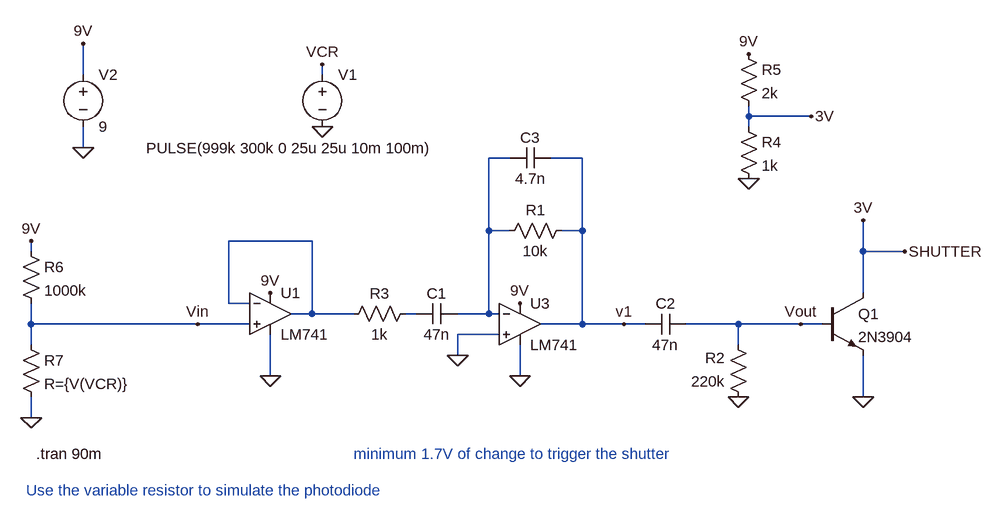
[diagram p0: schematic lightning trigger slow.asc]
lightning trigger slow.asc, the LTspice schematic file:
Version 4
SHEET 1 984 680
WIRE -560 -128 -560 -176
WIRE -192 -128 -192 -144
WIRE 464 -64 464 -80
WIRE 560 -64 464 -64
WIRE 464 -48 464 -64
WIRE -560 -16 -560 -48
WIRE 96 0 64 0
WIRE 208 0 160 0
WIRE 64 112 64 0
WIRE 96 112 64 112
WIRE 208 112 208 0
WIRE 208 112 176 112
WIRE -208 128 -336 128
WIRE -640 144 -640 128
WIRE 640 144 640 96
WIRE 704 144 640 144
WIRE 640 208 640 144
WIRE -336 224 -336 128
WIRE -304 224 -336 224
WIRE -208 240 -208 128
WIRE -208 240 -240 240
WIRE -144 240 -208 240
WIRE -48 240 -64 240
WIRE 64 240 64 112
WIRE 64 240 16 240
WIRE 80 240 64 240
WIRE -640 256 -640 224
WIRE -384 256 -640 256
WIRE -304 256 -384 256
WIRE 208 256 208 112
WIRE 208 256 144 256
WIRE 272 256 208 256
WIRE 304 256 272 256
WIRE 448 256 368 256
WIRE 544 256 448 256
WIRE 576 256 544 256
WIRE 80 272 16 272
WIRE -640 288 -640 256
WIRE 448 288 448 256
WIRE 16 304 16 272
WIRE -272 336 -272 272
WIRE 112 336 112 288
WIRE 640 368 640 304
WIRE -640 400 -640 368
FLAG 112 224 9V
FLAG 112 336 0
FLAG 544 256 Vout
FLAG -384 256 Vin
FLAG -192 -48 0
FLAG -560 -176 9V
FLAG -560 -16 0
FLAG 16 304 0
FLAG 448 368 0
FLAG 640 368 0
FLAG 464 -160 9V
FLAG -272 208 9V
FLAG -272 336 0
FLAG 704 144 SHUTTER
FLAG 464 32 0
FLAG 560 -64 3V
FLAG 640 96 3V
FLAG 272 256 v1
FLAG -192 -144 VCR
FLAG -640 400 0
FLAG -640 128 9V
SYMBOL cap 16 224 R90
WINDOW 0 0 32 VBottom 2
WINDOW 3 32 32 VTop 2
SYMATTR InstName C1
SYMATTR Value 47n
SYMBOL res 192 96 R90
WINDOW 0 0 56 VBottom 2
WINDOW 3 32 56 VTop 2
SYMATTR InstName R1
SYMATTR Value 10k
SYMBOL voltage -192 -144 R0
WINDOW 3 -271 129 Left 2
WINDOW 123 0 0 Left 0
WINDOW 39 0 0 Left 0
SYMATTR Value PULSE(999k 300k 0 25u 25u 10m 100m)
SYMATTR InstName V1
SYMBOL voltage -560 -144 R0
SYMATTR InstName V2
SYMATTR Value 9
SYMATTR SpiceLine Rser=0
SYMBOL cap 160 -16 R90
WINDOW 0 0 32 VBottom 2
WINDOW 3 32 32 VTop 2
SYMATTR InstName C3
SYMATTR Value 4.7n
SYMBOL cap 304 272 R270
WINDOW 0 32 32 VTop 2
WINDOW 3 0 32 VBottom 2
SYMATTR InstName C2
SYMATTR Value 47n
SYMBOL res 464 384 R180
WINDOW 0 36 76 Left 2
WINDOW 3 36 40 Left 2
SYMATTR InstName R2
SYMATTR Value 220k
SYMBOL res -160 256 R270
WINDOW 0 32 56 VTop 2
WINDOW 3 0 56 VBottom 2
SYMATTR InstName R3
SYMATTR Value 1k
SYMBOL res 448 -64 R0
SYMATTR InstName R4
SYMATTR Value 1k
SYMBOL OpAmps\\LM741 112 192 R0
SYMATTR InstName U3
SYMBOL OpAmps\\LM741 -272 176 R0
SYMATTR InstName U1
SYMBOL npn 576 208 R0
SYMATTR InstName Q1
SYMATTR Value 2N3904
SYMBOL res 448 -176 R0
SYMATTR InstName R5
SYMATTR Value 2k
SYMBOL res -656 128 R0
SYMATTR InstName R6
SYMATTR Value 1000k
SYMBOL res -656 272 R0
SYMATTR InstName R7
SYMATTR Value R={V(VCR)}
TEXT -632 456 Left 2 !.tran 90m
TEXT -648 512 Left 2 ;Use the variable resistor to simulate the photodiode
TEXT -144 456 Left 2 ;minimum 1.7V of change to trigger the shutter

The netlist it stands for:
* lightning trigger slow.asc
C1 N001 N003 47n
R1 v1 N001 10k
V1 VCR 0 PULSE(999k 300k 0 25u 25u 10m 100m)
V2 9V 0 9 Rser=0
C3 v1 N001 4.7n
C2 v1 Vout 47n
R2 0 Vout 220k
R3 N002 N003 1k
R4 3V 0 1k
XU3 0 N001 9V 0 v1 LM741  ; pins In+ In- V+ V- OUT
XU1 Vin N002 9V 0 N002 LM741  ; pins In+ In- V+ V- OUT
Q1 3V Vout 0 0 2N3904
R5 9V 3V 2k
R6 9V Vin 1000k
R7 Vin 0 R={V(VCR)}
.model NPN NPN
.model PNP PNP
.lib standard.bjt
.tran 90m
* Use the variable resistor to simulate the photodiode
* minimum 1.7V of change to trigger the shutter
.lib LM741.lib
.backanno
.end